# EAGLE design transmitter (EAGLE 9.6.0)
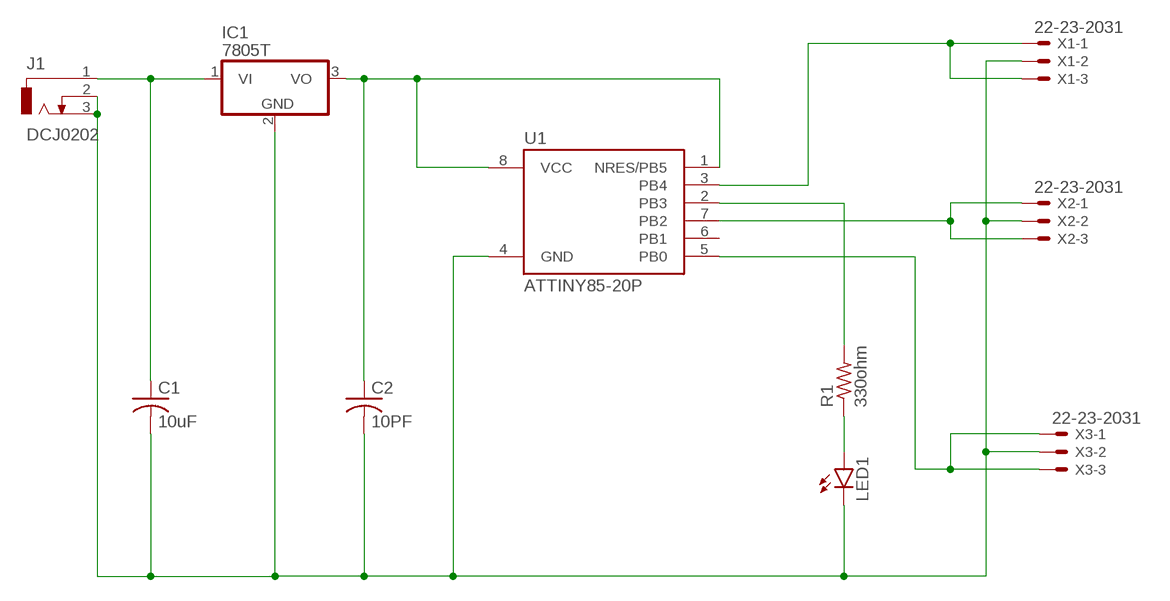
[diagram p0: schematic, sheet 1]

## Parts
C1  10uF  C-US025-024X044  [C025-024X044]
C2  10PF  C-US025-024X044  [C025-024X044]
IC1  7805T  [TO220H]
J1  DCJ0202  [DCJ0202]
LED1  LED3MM  [LED3MM]
R1  330ohm  R-US_0207/5V  [0207/5V]
U1  ATTINY85-20P  [PDIP08_300MIL]
X1  22-23-2031  [22-23-2031]
X2  22-23-2031  [22-23-2031]
X3  22-23-2031  [22-23-2031]

## Nets
N$1: C1.1 IC1.1(VI) J1.1
N$2: C1.2 C2.2 IC1.2(GND) J1.2 J1.3 LED1.K(C) U1.4(GND) X1.2 X2.2 X3.2
N$3: C2.1 IC1.3(VO) U1.1(NRES/PB5) U1.8(VCC)
N$4: U1.3(PB4) X1.1 X1.3
N$5: U1.5(PB0) X3.1 X3.3
N$7: R1.2 U1.2(PB3)
N$8: LED1.A R1.1
N$10: U1.7(PB2) X2.1 X2.3
Unconnected: U1.6(PB1)

## Library data of the parts
C1 C2 = rcl:C-US: CAPACITOR, American symbol; SPICEPREFIX: C
IC1 = linear:78*: Positive VOLTAGE REGULATOR Source: http://cache.national.com/ds/LM/LM78L05.pdf http://www.fairchildsemi.com/ds/LM/LM7805.pdf
J1 = con-jack:DCJ0202: DC POWER JACK Source: DCJ0202.pdf; OC_FARNELL: unknown; OC_NEWARK: unknown
LED1 = led:LED: LED OSRAM: - CHIPLED LG R971, LG N971, LY N971, LG Q971, LY Q971, LO R971, LY R971 LH N974, LH R974 LS Q976, LO Q976, LY Q976 LO Q996 - Hyper CHIPLED LW Q18S LB Q993, LB Q99A, LB R99A - SideLED LS A670, LO A670, LY A670, LG A670, LP A670 LB A673, LV A673, LT A673, LW A673 LH A674 LY A675 LS A676, LA A676, LO A676, LY A676, LW A676 LS A679, LY A679, LG A679 - Hyper Micro SIDELED® LS Y876, LA Y876, LO Y876, LY Y876 LT Y87S - SmartLED LW L88C, LW L88S LB L89C, LB L89S, LG L890 LS L89K, LO L89K, LY L89K LS L896, LA L896, LO L896, LY L896 - TOPLED LS T670, LO T670, LY T670, LG T670, LP T670 LSG T670, LSP T670, LSY T670, LOP T670, LYG T670 LG T671, LOG T671, LSG T671 LB T673, LV T673, LT T673, LW T673 LH T674 LS T676, LA T676, LO T676, LY T676, LB T676, LH T676, LSB T676, LW T676 LB T67C, LV T67C, LT T67C, LS T67K, LO T67K, LY T67K, LW E67C LS E67B, LA E67B, LO E67B, LY E67B, LB E67C, LV E67C, LT E67C LW T67C LS T679, LY T679, LG T679 LS T770, LO T770, LY T770, LG T770, LP T770 LB T773, LV T773, LT T773, LW T773 LH T774 LS E675, LA E675, LY E675, LS T675 LS T776, LA T776, LO T776, LY T776, LB T776 LHGB T686 LT T68C, LB T68C - Hyper Mini TOPLED® LB M676 - Mini TOPLED Santana® LG M470 LS M47K, LO M47K, LY M47K Source: http://www.osram.convergy.de LUXEON: - LUMILED® LXK2-PW12-R00, LXK2-PW12-S00, LXK2-PW14-U00, LXK2-PW14-V00 LXK2-PM12-R00, LXK2-PM12-S00, LXK2-PM14-U00 LXK2-PE12-Q00, LXK2-PE12-R00, LXK2-PE12-S00, LXK2-PE14-T00, LXK2-PE14-U00 LXK2-PB12-K00, LXK2-PB12-L00, LXK2-PB12-M00, LXK2-PB14-N00, LXK2-PB14-P00, LXK2-PB14-Q00 LXK2-PR12-L00, LXK2-PR12-M00, LXK2-PR14-Q00, LXK2-PR14-R00 LXK2-PD12-Q00, LXK2-PD12-R00, LXK2-PD12-S00 LXK2-PH12-R00, LXK2-PH12-S00 LXK2-PL12-P00, LXK2-PL12-Q00, LXK2-PL12-R00 Source: www.luxeon.com KINGBRIGHT: KA-3528ASYC Source: www.kingbright.com
R1 = rcl:R-US_: RESISTOR, American symbol; SPICEPREFIX: R
U1 = _hhn_attiny25_45_85:ATTINY85*: ATMEL ATtiny 85 Packages: P = PDIP 08 30mil S = SOIC 08 EIAJ 208mil Technologies Note: for complete ordering code (temp. range, finish, tape&reel etc.) see www.atmel.com • Supply Voltage: V = (1.8…5.5)V | [blank] = (2.7…5.5)V • Speed: 10 = 10 MHz | 20 = 20 MHz Author: Dipl.-Ing. FH Rainer Bayer HHN Hochschule Heilbronn (Heilbronn University), rainer.bayer@hs-heilbronn.de Ingenieurbüro ing-rb, mail@ing-rb.de
X1-X3 = con-molex:22-23-2031: .100" (2.54mm) Center Header - 3 Pin; MF: MOLEX; MPN: 22-23-2031; OC_FARNELL: 1462950; OC_NEWARK: 30C0862

## Board
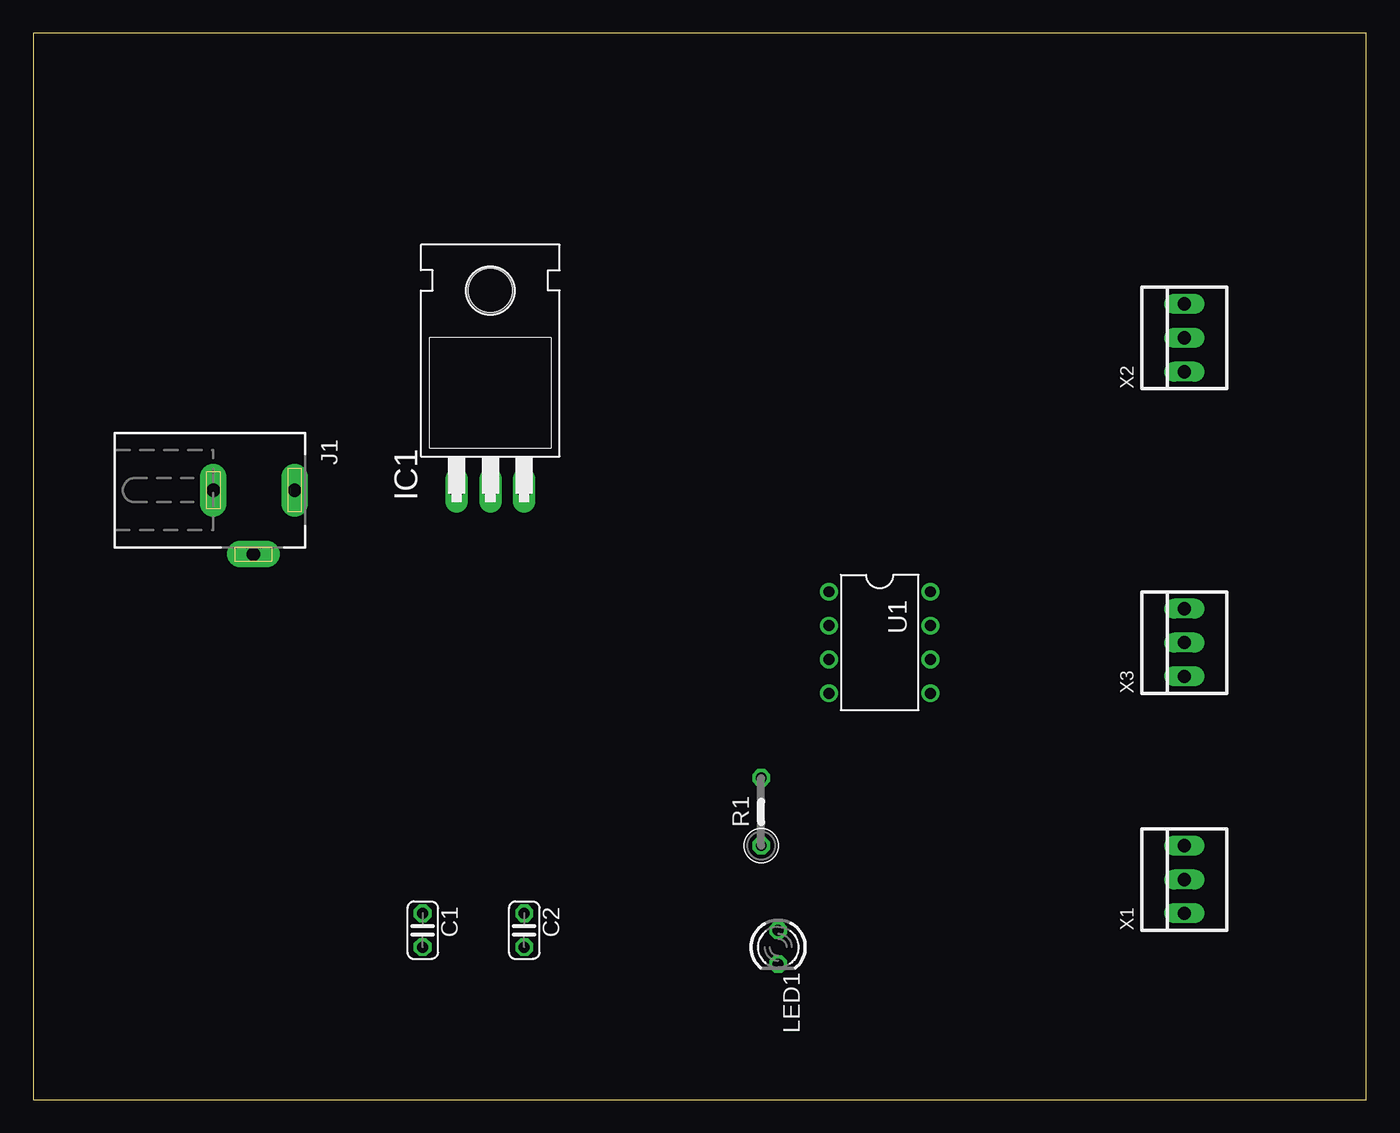
[diagram p1: board, top side]
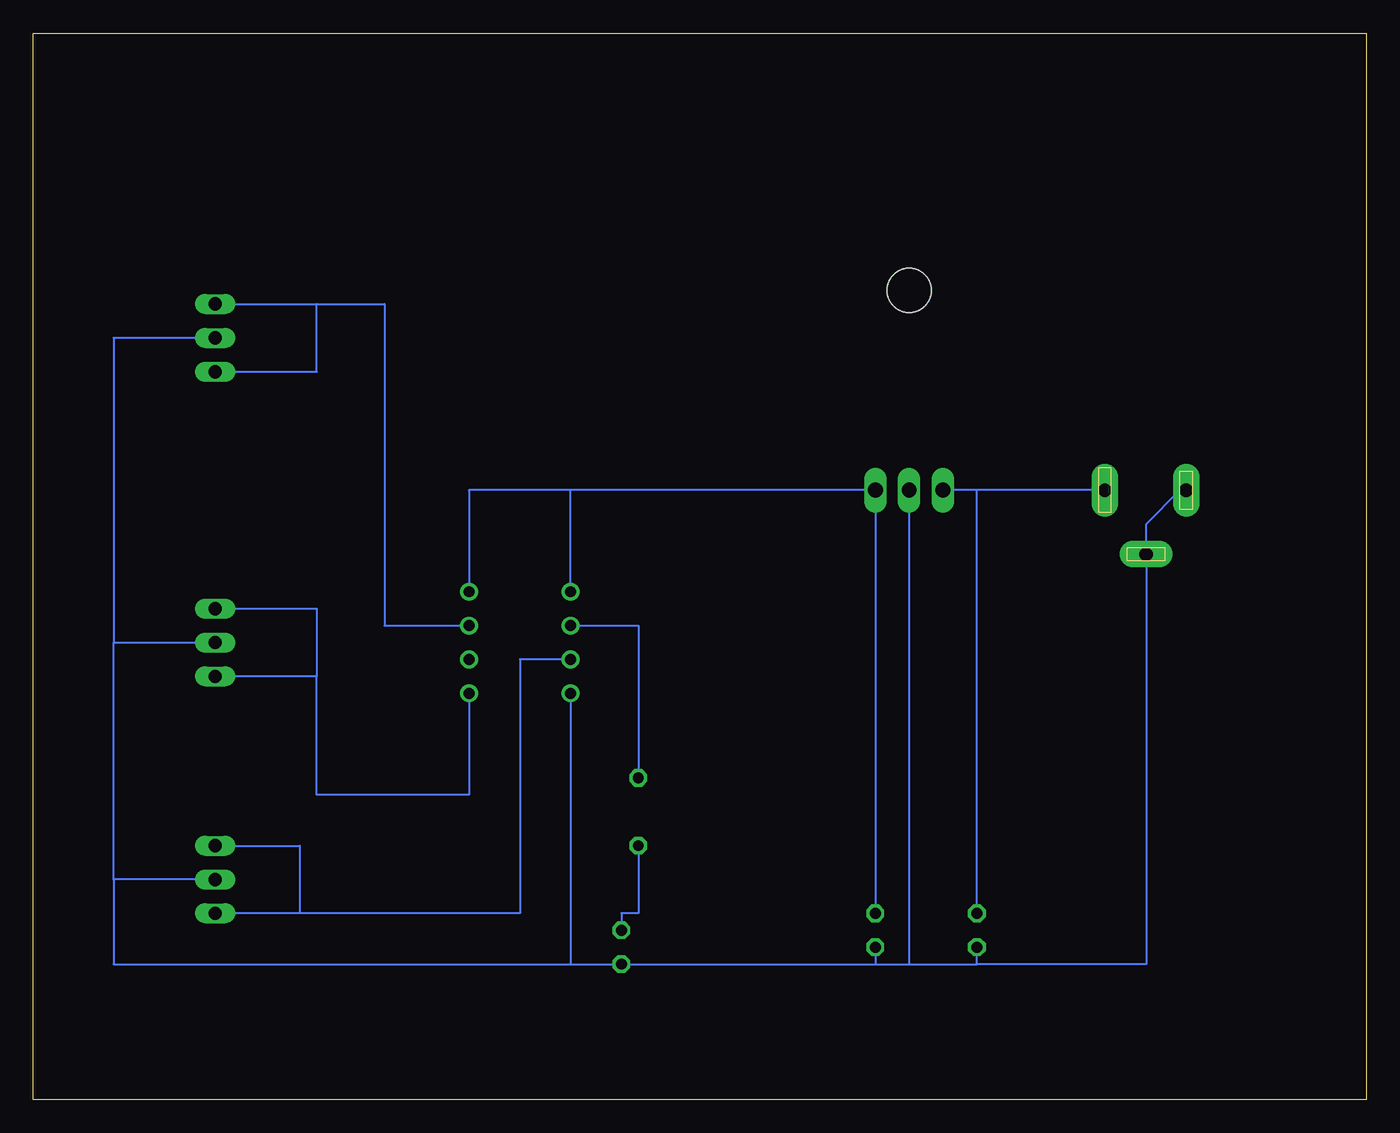
[diagram p2: board, bottom side, seen from below]

Size 100 x 80 mm. Coordinates in mm from the lower left corner, seen from the top.
Outline: 0,0 100,0 100,80 0,80 0,0
Copper layers (1*16): Top 0.035mm / dielectric 1.5mm / Bottom 0.035mm
Design rules "default": minimum track width 6mil, minimum drill 0.35mm, track to track 6mil, track to pad 6mil, pad to pad 6mil, via to via 6mil, smd to smd 6mil, copper to edge 40mil, drill to drill 6mil, minimum pad ring 10mil, minimum via ring 8mil, stop-mask expansion 4mil, vias tented up to drill 0mil, thermal gap 10mil

### Footprints (pad centres in the part's own frame; a part is rotated, then mirrored left to right if it is on the bottom)
C025-024X044 = drill 0.813 octagon: 1 -1.27,0; 2 1.27,0
TO220H = drill 1.118 long: 1 -2.54,-10.16; 2 0,-10.16; 3 2.54,-10.16 | hole 3.302: 0,4.826
DCJ0202 = drill 1 pad 2 long: 1 0,3.1; 2 4.8,0; 3 0,-3
LED3MM = drill 0.813 octagon: A -1.27,0; K 1.27,0
0207/5V = drill 0.813 octagon: 1 -2.54,0; 2 2.54,0
PDIP08_300MIL = drill 0.813: 1 -3.81,-3.81; 2 -1.27,-3.81; 3 1.27,-3.81; 4 3.81,-3.81; 5 3.81,3.81; 6 1.27,3.81; 7 -1.27,3.81; 8 -3.81,3.81
22-23-2031 = drill 1 long: 1 -2.54,0; 2 0,0; 3 2.54,0

### Placement (x,y rotation side)
C1  29.21,12.7 270 top
C2  36.83,12.7 270 top
IC1  34.29,55.88 0 top
J1  16.51,45.72 270 top
LED1  55.88,11.43 270 top
R1  54.61,21.59 90 top
U1  63.5,34.29 270 top
X1  86.36,16.51 90 top
X2  86.36,57.15 90 top
X3  86.36,34.29 90 top

### Tracks (layer width: path | path; a pad name or v marks a point on that pad's centre or on a via)
N$1
  Bottom 0.152: J1.1 29.21,45.72 | 29.21,45.72 IC1.1 | C1.1 29.21,45.72
N$2
  Bottom 0.152: 36.83,10.16 LED1.K 59.69,10.16 | C2.2 36.83,10.16 | 36.83,10.16 34.29,10.16 | 34.29,10.16 29.21,10.16 | 29.21,10.16 C1.2 | J1.3 13.97,45.72 16.51,43.18 J1.2 16.51,10.16 29.21,10.16 | IC1.2 34.29,10.16 | X2.2 93.98,57.15 93.98,34.29 | 93.98,34.29 X3.2 | X1.2 93.98,16.51 | 93.98,16.51 93.98,34.29 | U1.4 59.69,10.16 | 93.98,16.51 93.98,10.16 59.69,10.16
N$3
  Bottom 0.152: C2.1 IC1.3 59.69,45.72 | 59.69,45.72 67.31,45.72 U1.8 | U1.1 59.69,45.72
N$4
  Bottom 0.152: U1.3 63.5,33.02 63.5,13.97 80.01,13.97 | 80.01,13.97 X1.1 | X1.3 80.01,19.05 80.01,13.97
N$5
  Bottom 0.152: X3.3 78.74,36.83 78.74,31.75 | 78.74,31.75 X3.1 | U1.5 67.31,22.86 78.74,22.86 78.74,31.75
N$7
  Bottom 0.152: U1.2 54.61,35.56 R1.2
N$8
  Bottom 0.152: R1.1 54.61,13.97 55.88,13.97 LED1.A
N$10
  Bottom 0.152: X2.3 78.74,59.69 | 78.74,59.69 73.66,59.69 73.66,35.56 U1.7 | X2.1 78.74,54.61 78.74,59.69